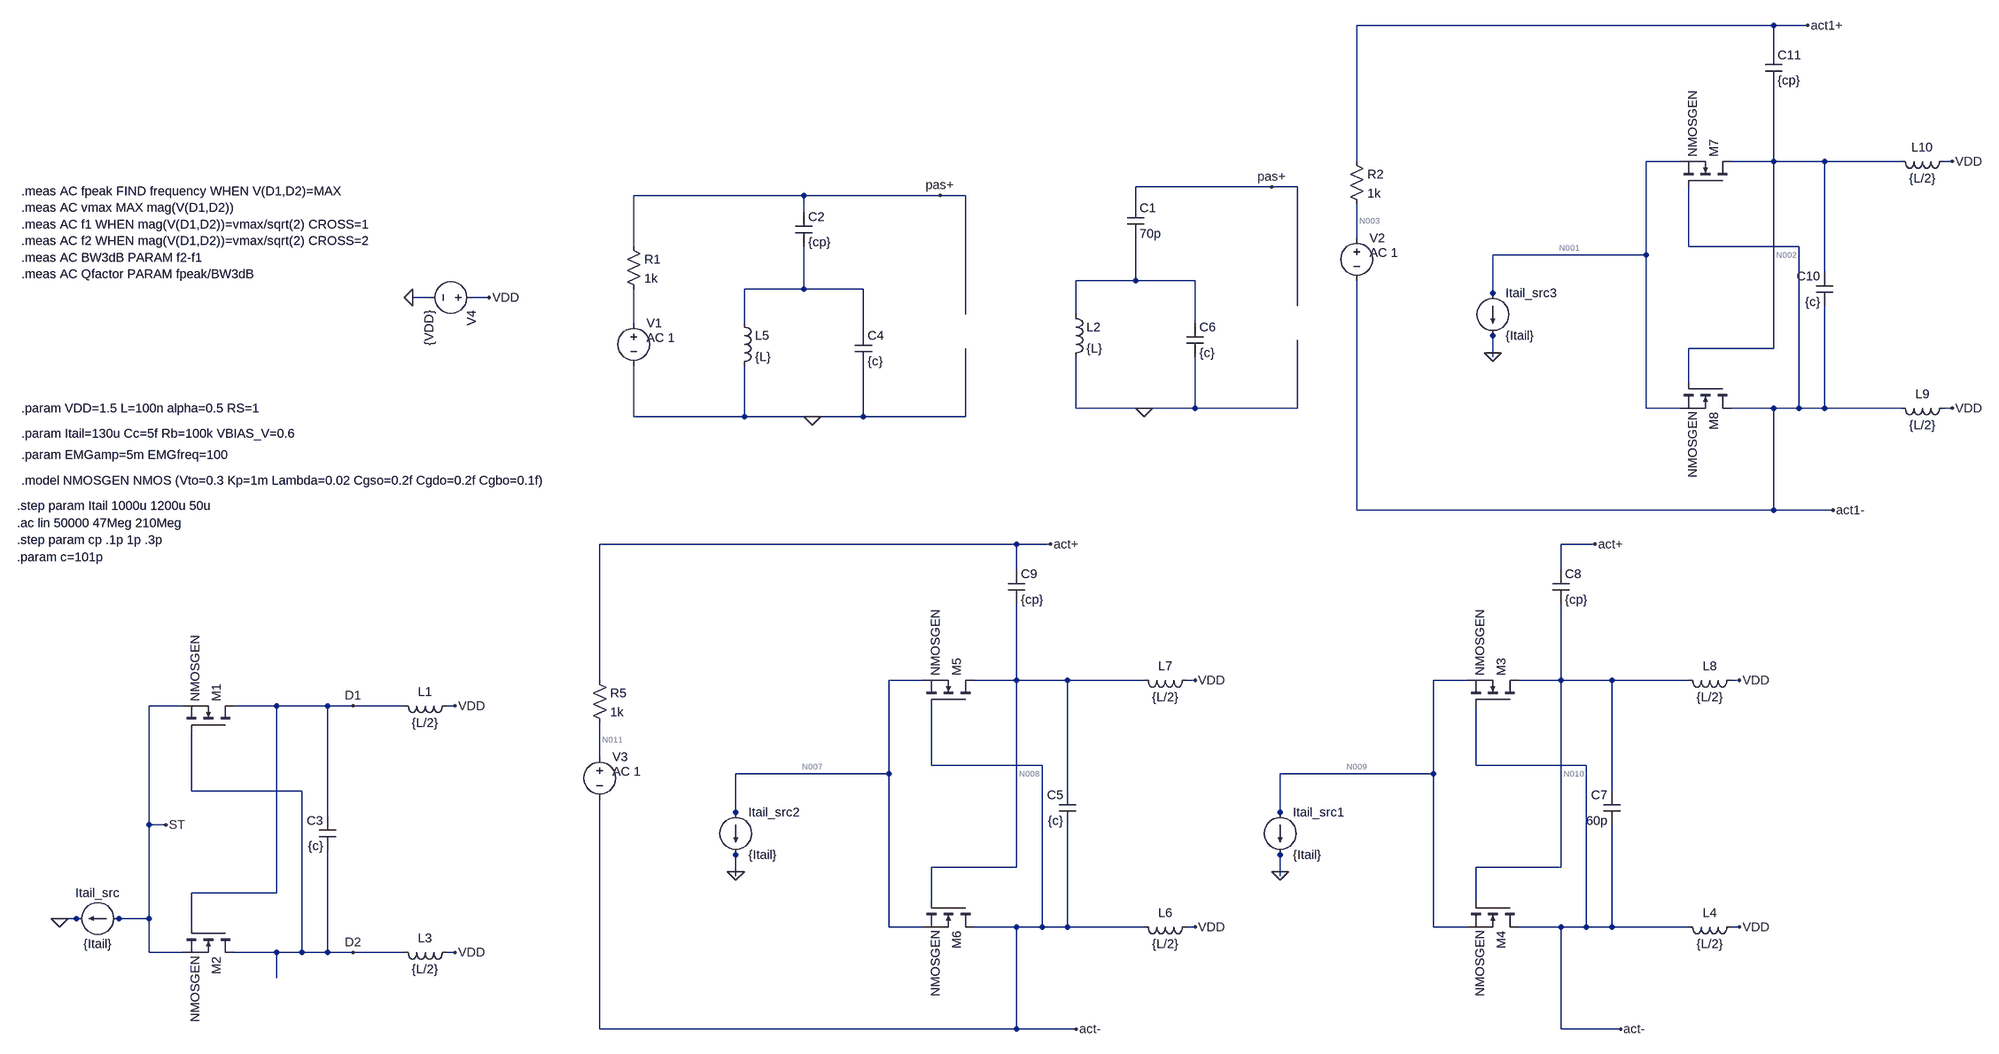
[diagram p0: schematic CROSS COUPLED1.asc]
CROSS COUPLED1.asc, the LTspice schematic file:
Version 4.1
SHEET 1 5816 1324
WIRE 2192 -1792 1408 -1792
WIRE 2256 -1792 2192 -1792
WIRE 2192 -1744 2192 -1792
WIRE 1408 -1536 1408 -1792
WIRE 2016 -1536 1952 -1536
WIRE 2192 -1536 2192 -1680
WIRE 2192 -1536 2112 -1536
WIRE 2288 -1536 2192 -1536
WIRE 2432 -1536 2288 -1536
WIRE 2528 -1536 2512 -1536
WIRE 1248 -1488 992 -1488
WIRE 1296 -1488 1248 -1488
WIRE 368 -1472 48 -1472
WIRE 624 -1472 368 -1472
WIRE 672 -1472 624 -1472
WIRE 992 -1456 992 -1488
WIRE 368 -1440 368 -1472
WIRE 1408 -1392 1408 -1456
WIRE 48 -1376 48 -1472
WIRE 2032 -1376 2032 -1488
WIRE 2240 -1376 2032 -1376
WIRE 1952 -1360 1952 -1536
WIRE 1952 -1360 1664 -1360
WIRE 2288 -1328 2288 -1536
WIRE 992 -1312 992 -1392
WIRE 992 -1312 880 -1312
WIRE 1104 -1312 992 -1312
WIRE 368 -1296 368 -1376
WIRE 368 -1296 256 -1296
WIRE 480 -1296 368 -1296
WIRE 1664 -1288 1664 -1360
WIRE -336 -1280 -368 -1280
WIRE -224 -1280 -256 -1280
WIRE 1664 -1280 1664 -1288
WIRE 1296 -1264 1296 -1488
WIRE 672 -1248 672 -1472
WIRE 880 -1248 880 -1312
WIRE 48 -1232 48 -1296
WIRE 256 -1232 256 -1296
WIRE 1104 -1232 1104 -1312
WIRE 480 -1216 480 -1296
WIRE 1664 -1208 1664 -1216
WIRE 2192 -1184 2192 -1536
WIRE 2192 -1184 2032 -1184
WIRE 1664 -1176 1664 -1208
WIRE 1664 -1168 1664 -1176
WIRE 2032 -1120 2032 -1184
WIRE 880 -1072 880 -1168
WIRE 1008 -1072 880 -1072
WIRE 1104 -1072 1104 -1168
WIRE 1104 -1072 1008 -1072
WIRE 1296 -1072 1296 -1200
WIRE 1296 -1072 1104 -1072
WIRE 1952 -1072 1952 -1360
WIRE 2016 -1072 1952 -1072
WIRE 2192 -1072 2112 -1072
WIRE 2240 -1072 2240 -1376
WIRE 2240 -1072 2192 -1072
WIRE 2288 -1072 2288 -1264
WIRE 2288 -1072 2240 -1072
WIRE 2432 -1072 2288 -1072
WIRE 2528 -1072 2512 -1072
WIRE 48 -1056 48 -1152
WIRE 256 -1056 256 -1152
WIRE 256 -1056 48 -1056
WIRE 384 -1056 256 -1056
WIRE 480 -1056 480 -1152
WIRE 480 -1056 384 -1056
WIRE 672 -1056 672 -1184
WIRE 672 -1056 480 -1056
WIRE 1408 -880 1408 -1312
WIRE 2192 -880 2192 -1072
WIRE 2192 -880 1408 -880
WIRE 2304 -880 2192 -880
WIRE 768 -816 -16 -816
WIRE 832 -816 768 -816
WIRE 1856 -816 1792 -816
WIRE 768 -768 768 -816
WIRE 1792 -768 1792 -816
WIRE -16 -560 -16 -816
WIRE 592 -560 528 -560
WIRE 768 -560 768 -704
WIRE 768 -560 688 -560
WIRE 864 -560 768 -560
WIRE 1008 -560 864 -560
WIRE 1104 -560 1088 -560
WIRE 1616 -560 1552 -560
WIRE 1792 -560 1792 -704
WIRE 1792 -560 1712 -560
WIRE 1888 -560 1792 -560
WIRE 2032 -560 1888 -560
WIRE 2128 -560 2112 -560
WIRE -800 -512 -864 -512
WIRE -624 -512 -704 -512
WIRE -528 -512 -624 -512
WIRE -480 -512 -528 -512
WIRE -384 -512 -480 -512
WIRE -288 -512 -304 -512
WIRE -16 -416 -16 -480
WIRE 608 -400 608 -512
WIRE 816 -400 608 -400
WIRE 1632 -400 1632 -512
WIRE 1840 -400 1632 -400
WIRE 528 -384 528 -560
WIRE 528 -384 240 -384
WIRE 1552 -384 1552 -560
WIRE 1552 -384 1264 -384
WIRE -784 -352 -784 -464
WIRE -576 -352 -784 -352
WIRE 864 -352 864 -560
WIRE 1888 -352 1888 -560
WIRE 240 -312 240 -384
WIRE 1264 -312 1264 -384
WIRE -528 -304 -528 -512
WIRE 240 -304 240 -312
WIRE 1264 -304 1264 -312
WIRE -864 -288 -864 -512
WIRE -832 -288 -864 -288
WIRE 240 -232 240 -240
WIRE 1264 -232 1264 -240
WIRE 768 -208 768 -560
WIRE 768 -208 608 -208
WIRE 1792 -208 1792 -560
WIRE 1792 -208 1632 -208
WIRE 240 -200 240 -232
WIRE 1264 -200 1264 -232
WIRE 240 -192 240 -200
WIRE 1264 -192 1264 -200
WIRE -624 -160 -624 -512
WIRE -624 -160 -784 -160
WIRE 608 -144 608 -208
WIRE 1632 -144 1632 -208
WIRE -1032 -112 -1040 -112
WIRE -1000 -112 -1032 -112
WIRE -992 -112 -1000 -112
WIRE -920 -112 -928 -112
WIRE -864 -112 -864 -288
WIRE -864 -112 -920 -112
WIRE -784 -96 -784 -160
WIRE 528 -96 528 -384
WIRE 592 -96 528 -96
WIRE 768 -96 688 -96
WIRE 816 -96 816 -400
WIRE 816 -96 768 -96
WIRE 864 -96 864 -288
WIRE 864 -96 816 -96
WIRE 1008 -96 864 -96
WIRE 1104 -96 1088 -96
WIRE 1552 -96 1552 -384
WIRE 1616 -96 1552 -96
WIRE 1792 -96 1712 -96
WIRE 1840 -96 1840 -400
WIRE 1840 -96 1792 -96
WIRE 1888 -96 1888 -288
WIRE 1888 -96 1840 -96
WIRE 2032 -96 1888 -96
WIRE 2128 -96 2112 -96
WIRE -864 -48 -864 -112
WIRE -800 -48 -864 -48
WIRE -624 -48 -704 -48
WIRE -576 -48 -576 -352
WIRE -576 -48 -624 -48
WIRE -528 -48 -528 -240
WIRE -528 -48 -576 -48
WIRE -480 -48 -528 -48
WIRE -384 -48 -480 -48
WIRE -288 -48 -304 -48
WIRE -624 0 -624 -48
WIRE -16 96 -16 -336
WIRE 768 96 768 -96
WIRE 768 96 -16 96
WIRE 880 96 768 96
WIRE 1792 96 1792 -96
WIRE 1904 96 1792 96
FLAG -1032 -112 0
FLAG -288 -48 VDD
FLAG -288 -512 VDD
FLAG -480 -48 D2
FLAG -480 -512 D1
FLAG -832 -288 ST
FLAG -224 -1280 VDD
FLAG -368 -1280 0
FLAG 1104 -96 VDD
FLAG 1104 -560 VDD
FLAG 240 -200 0
FLAG 832 -816 act+
FLAG 880 96 act-
FLAG 624 -1472 pas+
FLAG 384 -1056 0
FLAG 1248 -1488 pas+
FLAG 1008 -1072 0
FLAG 2128 -96 VDD
FLAG 2128 -560 VDD
FLAG 1264 -200 0
FLAG 1856 -816 act+
FLAG 1904 96 act-
FLAG 2528 -1072 VDD
FLAG 2528 -1536 VDD
FLAG 1664 -1176 0
FLAG 2256 -1792 act1+
FLAG 2304 -880 act1-
SYMBOL current -920 -112 R90
WINDOW 0 -32 40 VBottom 2
WINDOW 3 32 40 VTop 2
SYMATTR InstName Itail_src
SYMATTR Value {Itail}
SYMBOL nmos -704 -464 M270
SYMATTR InstName M1
SYMATTR Value NMOSGEN
SYMBOL nmos -704 -96 R90
SYMATTR InstName M2
SYMATTR Value NMOSGEN
SYMBOL ind -288 -64 R90
WINDOW 0 5 56 VBottom 2
WINDOW 3 32 56 VTop 2
SYMATTR InstName L3
SYMATTR Value {L/2}
SYMATTR SpiceLine Rser={RS/2}
SYMBOL ind -288 -528 R90
WINDOW 0 5 56 VBottom 2
WINDOW 3 32 56 VTop 2
SYMATTR InstName L1
SYMATTR Value {L/2}
SYMATTR SpiceLine Rser={RS/2}
SYMBOL cap -512 -240 R180
WINDOW 0 24 56 Left 2
WINDOW 3 24 8 Left 2
SYMATTR InstName C3
SYMATTR Value {c}
SYMBOL voltage -240 -1280 R90
WINDOW 123 0 0 Left 0
WINDOW 39 0 0 Left 0
SYMATTR InstName V4
SYMATTR Value {VDD}
SYMBOL voltage 48 -1248 R0
WINDOW 123 24 44 Left 2
WINDOW 39 0 0 Left 0
SYMATTR Value2 AC 1
SYMATTR InstName V1
SYMATTR Value ""
SYMBOL res 32 -1392 R0
SYMATTR InstName R1
SYMATTR Value 1k
SYMBOL cap 352 -1440 R0
SYMATTR InstName C2
SYMATTR Value {cp}
SYMBOL cap 464 -1216 R0
SYMATTR InstName C4
SYMATTR Value {c}
SYMBOL ind 240 -1248 R0
SYMATTR InstName L5
SYMATTR Value {L}
SYMATTR SpiceLine Rser=1
SYMBOL nmos 688 -512 M270
SYMATTR InstName M5
SYMATTR Value NMOSGEN
SYMBOL nmos 688 -144 R90
SYMATTR InstName M6
SYMATTR Value NMOSGEN
SYMBOL ind 1104 -112 R90
WINDOW 0 5 56 VBottom 2
WINDOW 3 32 56 VTop 2
SYMATTR InstName L6
SYMATTR Value {L/2}
SYMATTR SpiceLine Rser={RS/2}
SYMBOL ind 1104 -576 R90
WINDOW 0 5 56 VBottom 2
WINDOW 3 32 56 VTop 2
SYMATTR InstName L7
SYMATTR Value {L/2}
SYMATTR SpiceLine Rser={RS/2}
SYMBOL cap 880 -288 R180
WINDOW 0 24 56 Left 2
WINDOW 3 24 8 Left 2
SYMATTR InstName C5
SYMATTR Value {c}
SYMBOL voltage -16 -432 R0
WINDOW 123 24 44 Left 2
WINDOW 39 0 0 Left 0
SYMATTR Value2 AC 1
SYMATTR InstName V3
SYMATTR Value ""
SYMBOL res -32 -576 R0
SYMATTR InstName R5
SYMATTR Value 1k
SYMBOL cap 752 -768 R0
SYMATTR InstName C9
SYMATTR Value {cp}
SYMBOL current 240 -312 R0
SYMATTR InstName Itail_src2
SYMATTR Value {Itail}
SYMBOL cap 976 -1456 R0
SYMATTR InstName C1
SYMATTR Value 70p
SYMBOL cap 1088 -1232 R0
SYMATTR InstName C6
SYMATTR Value {c}
SYMBOL ind 864 -1264 R0
SYMATTR InstName L2
SYMATTR Value {L}
SYMATTR SpiceLine Rser=1
SYMBOL nmos 1712 -512 M270
SYMATTR InstName M3
SYMATTR Value NMOSGEN
SYMBOL nmos 1712 -144 R90
SYMATTR InstName M4
SYMATTR Value NMOSGEN
SYMBOL ind 2128 -112 R90
WINDOW 0 5 56 VBottom 2
WINDOW 3 32 56 VTop 2
SYMATTR InstName L4
SYMATTR Value {L/2}
SYMATTR SpiceLine Rser={RS/2}
SYMBOL ind 2128 -576 R90
WINDOW 0 5 56 VBottom 2
WINDOW 3 32 56 VTop 2
SYMATTR InstName L8
SYMATTR Value {L/2}
SYMATTR SpiceLine Rser={RS/2}
SYMBOL cap 1904 -288 R180
WINDOW 0 24 56 Left 2
WINDOW 3 24 8 Left 2
SYMATTR InstName C7
SYMATTR Value 60p
SYMBOL cap 1776 -768 R0
SYMATTR InstName C8
SYMATTR Value {cp}
SYMBOL current 1264 -312 R0
SYMATTR InstName Itail_src1
SYMATTR Value {Itail}
SYMBOL nmos 2112 -1488 M270
SYMATTR InstName M7
SYMATTR Value NMOSGEN
SYMBOL nmos 2112 -1120 R90
SYMATTR InstName M8
SYMATTR Value NMOSGEN
SYMBOL ind 2528 -1088 R90
WINDOW 0 5 56 VBottom 2
WINDOW 3 32 56 VTop 2
SYMATTR InstName L9
SYMATTR Value {L/2}
SYMATTR SpiceLine Rser={RS/2}
SYMBOL ind 2528 -1552 R90
WINDOW 0 5 56 VBottom 2
WINDOW 3 32 56 VTop 2
SYMATTR InstName L10
SYMATTR Value {L/2}
SYMATTR SpiceLine Rser={RS/2}
SYMBOL cap 2304 -1264 R180
WINDOW 0 24 56 Left 2
WINDOW 3 24 8 Left 2
SYMATTR InstName C10
SYMATTR Value {c}
SYMBOL voltage 1408 -1408 R0
WINDOW 123 24 44 Left 2
WINDOW 39 0 0 Left 0
SYMATTR Value2 AC 1
SYMATTR InstName V2
SYMATTR Value ""
SYMBOL res 1392 -1552 R0
SYMATTR InstName R2
SYMATTR Value 1k
SYMBOL cap 2176 -1744 R0
SYMATTR InstName C11
SYMATTR Value {cp}
SYMBOL current 1664 -1288 R0
SYMATTR InstName Itail_src3
SYMATTR Value {Itail}
TEXT -1104 -1072 Left 2 !.param VDD=1.5 L=100n alpha=0.5 RS=1
TEXT -1104 -1024 Left 2 !.param Itail=130u Cc=5f Rb=100k VBIAS_V=0.6
TEXT -1104 -984 Left 2 !.param EMGamp=5m EMGfreq=100
TEXT -1104 -936 Left 2 !.model NMOSGEN NMOS (Vto=0.3 Kp=1m Lambda=0.02 Cgso=0.2f Cgdo=0.2f Cgbo=0.1f)
TEXT -1112 -888 Left 2 !.step param Itail 1000u 1200u 50u
TEXT -1112 -856 Left 2 !.ac lin 50000 47Meg 210Meg
TEXT -1112 -824 Left 2 !.step param cp .1p 1p .3p
TEXT -1104 -1480 Left 2 !.meas AC fpeak FIND frequency WHEN V(D1,D2)=MAX\n.meas AC vmax MAX mag(V(D1,D2))\n.meas AC f1 WHEN mag(V(D1,D2))=vmax/sqrt(2) CROSS=1\n.meas AC f2 WHEN mag(V(D1,D2))=vmax/sqrt(2) CROSS=2\n.meas AC BW3dB PARAM f2-f1\n.meas AC Qfactor PARAM fpeak/BW3dB
TEXT -1112 -792 Left 2 !.param c=101p

The netlist it stands for:
* CROSS COUPLED1.asc
Itail_src ST 0 {Itail}
M1 D1 D2 ST ST NMOSGEN
M2 D2 D1 ST ST NMOSGEN
L3 VDD D2 {L/2} Rser={RS/2}
L1 VDD D1 {L/2} Rser={RS/2}
C3 D2 D1 {c}
V4 VDD 0 {VDD}
V1 N006 0 AC 1
R1 pas+ N006 1k
C2 pas+ N005 {cp}
C4 N005 0 {c}
L5 N005 0 {L} Rser=1
M5 N008 act- N007 N007 NMOSGEN
M6 act- N008 N007 N007 NMOSGEN
L6 VDD act- {L/2} Rser={RS/2}
L7 VDD N008 {L/2} Rser={RS/2}
C5 act- N008 {c}
V3 N011 act- AC 1
R5 act+ N011 1k
C9 act+ N008 {cp}
Itail_src2 N007 0 {Itail}
C1 pas+ N004 70p
C6 N004 0 {c}
L2 N004 0 {L} Rser=1
M3 N010 act- N009 N009 NMOSGEN
M4 act- N010 N009 N009 NMOSGEN
L4 VDD act- {L/2} Rser={RS/2}
L8 VDD N010 {L/2} Rser={RS/2}
C7 act- N010 60p
C8 act+ N010 {cp}
Itail_src1 N009 0 {Itail}
M7 N002 act1- N001 N001 NMOSGEN
M8 act1- N002 N001 N001 NMOSGEN
L9 VDD act1- {L/2} Rser={RS/2}
L10 VDD N002 {L/2} Rser={RS/2}
C10 act1- N002 {c}
V2 N003 act1- AC 1
R2 act1+ N003 1k
C11 act1+ N002 {cp}
Itail_src3 N001 0 {Itail}
.model NMOS NMOS
.model PMOS PMOS
.lib standard.mos
.param VDD=1.5 L=100n alpha=0.5 RS=1
.param Itail=130u Cc=5f Rb=100k VBIAS_V=0.6
.param EMGamp=5m EMGfreq=100
.model NMOSGEN NMOS (Vto=0.3 Kp=1m Lambda=0.02 Cgso=0.2f Cgdo=0.2f Cgbo=0.1f)
.step param Itail 1000u 1200u 50u
.ac lin 50000 47Meg 210Meg
.step param cp .1p 1p .3p
.meas AC fpeak FIND frequency WHEN V(D1,D2)=MAX
.meas AC vmax MAX mag(V(D1,D2))
.meas AC f1 WHEN mag(V(D1,D2))=vmax/sqrt(2) CROSS=1
.meas AC f2 WHEN mag(V(D1,D2))=vmax/sqrt(2) CROSS=2
.meas AC BW3dB PARAM f2-f1
.meas AC Qfactor PARAM fpeak/BW3dB
.param c=101p
.backanno
.end

* Results of the author's LTspice run, read from the files saved beside the schematic
* Operating Point (first step), zero values left out:
*   V(act+) = 1.5 V
*   V(act-) = 1.5 V
*   V(act1+) = 1.5 V
*   V(act1-) = 1.5 V
*   V(d1) = 1.5 V
*   V(d2) = 1.5 V
*   V(n001) = 212.4 mV
*   V(n002) = 1.5 V
*   V(n003) = 1.5 V
*   V(n007) = 212.4 mV
*   V(n008) = 1.5 V
*   V(n009) = 212.4 mV
*   V(n010) = 1.5 V
*   V(n011) = 1.5 V
*   V(st) = 212.4 mV
*   V(vdd) = 1.5 V
*   I(Itail_src) = 1 mA
*   I(Itail_src1) = 1 mA
*   I(Itail_src2) = 1 mA
*   I(Itail_src3) = 1 mA
*   I(L1) = 500 µA
*   I(L10) = 500 µA
*   I(L3) = 500 µA
*   I(L4) = 500 µA
*   I(L6) = 500 µA
*   I(L7) = 500 µA
*   I(L8) = 500 µA
*   I(L9) = 500 µA
*   I(V4) = -4 mA
*   Ib(M1) = -1.297 pA
*   Ib(M2) = -1.297 pA
*   Ib(M3) = -1.297 pA
*   Ib(M4) = -1.297 pA
*   Ib(M5) = -1.297 pA
*   Ib(M6) = -1.297 pA
*   Ib(M7) = -1.297 pA
*   Ib(M8) = -1.297 pA
*   Id(M1) = 500 µA
*   Id(M2) = 500 µA
*   Id(M3) = 500 µA
*   Id(M4) = 500 µA
*   Id(M5) = 500 µA
*   Id(M6) = 500 µA
*   Id(M7) = 500 µA
*   Id(M8) = 500 µA
*   Is(M1) = -500 µA
*   Is(M2) = -500 µA
*   Is(M3) = -500 µA
*   Is(M4) = -500 µA
*   Is(M5) = -500 µA
*   Is(M6) = -500 µA
*   Is(M7) = -500 µA
*   Is(M8) = -500 µA